# EAGLE schematic Programmable AC Series Limiter (EAGLE 7.6.0)
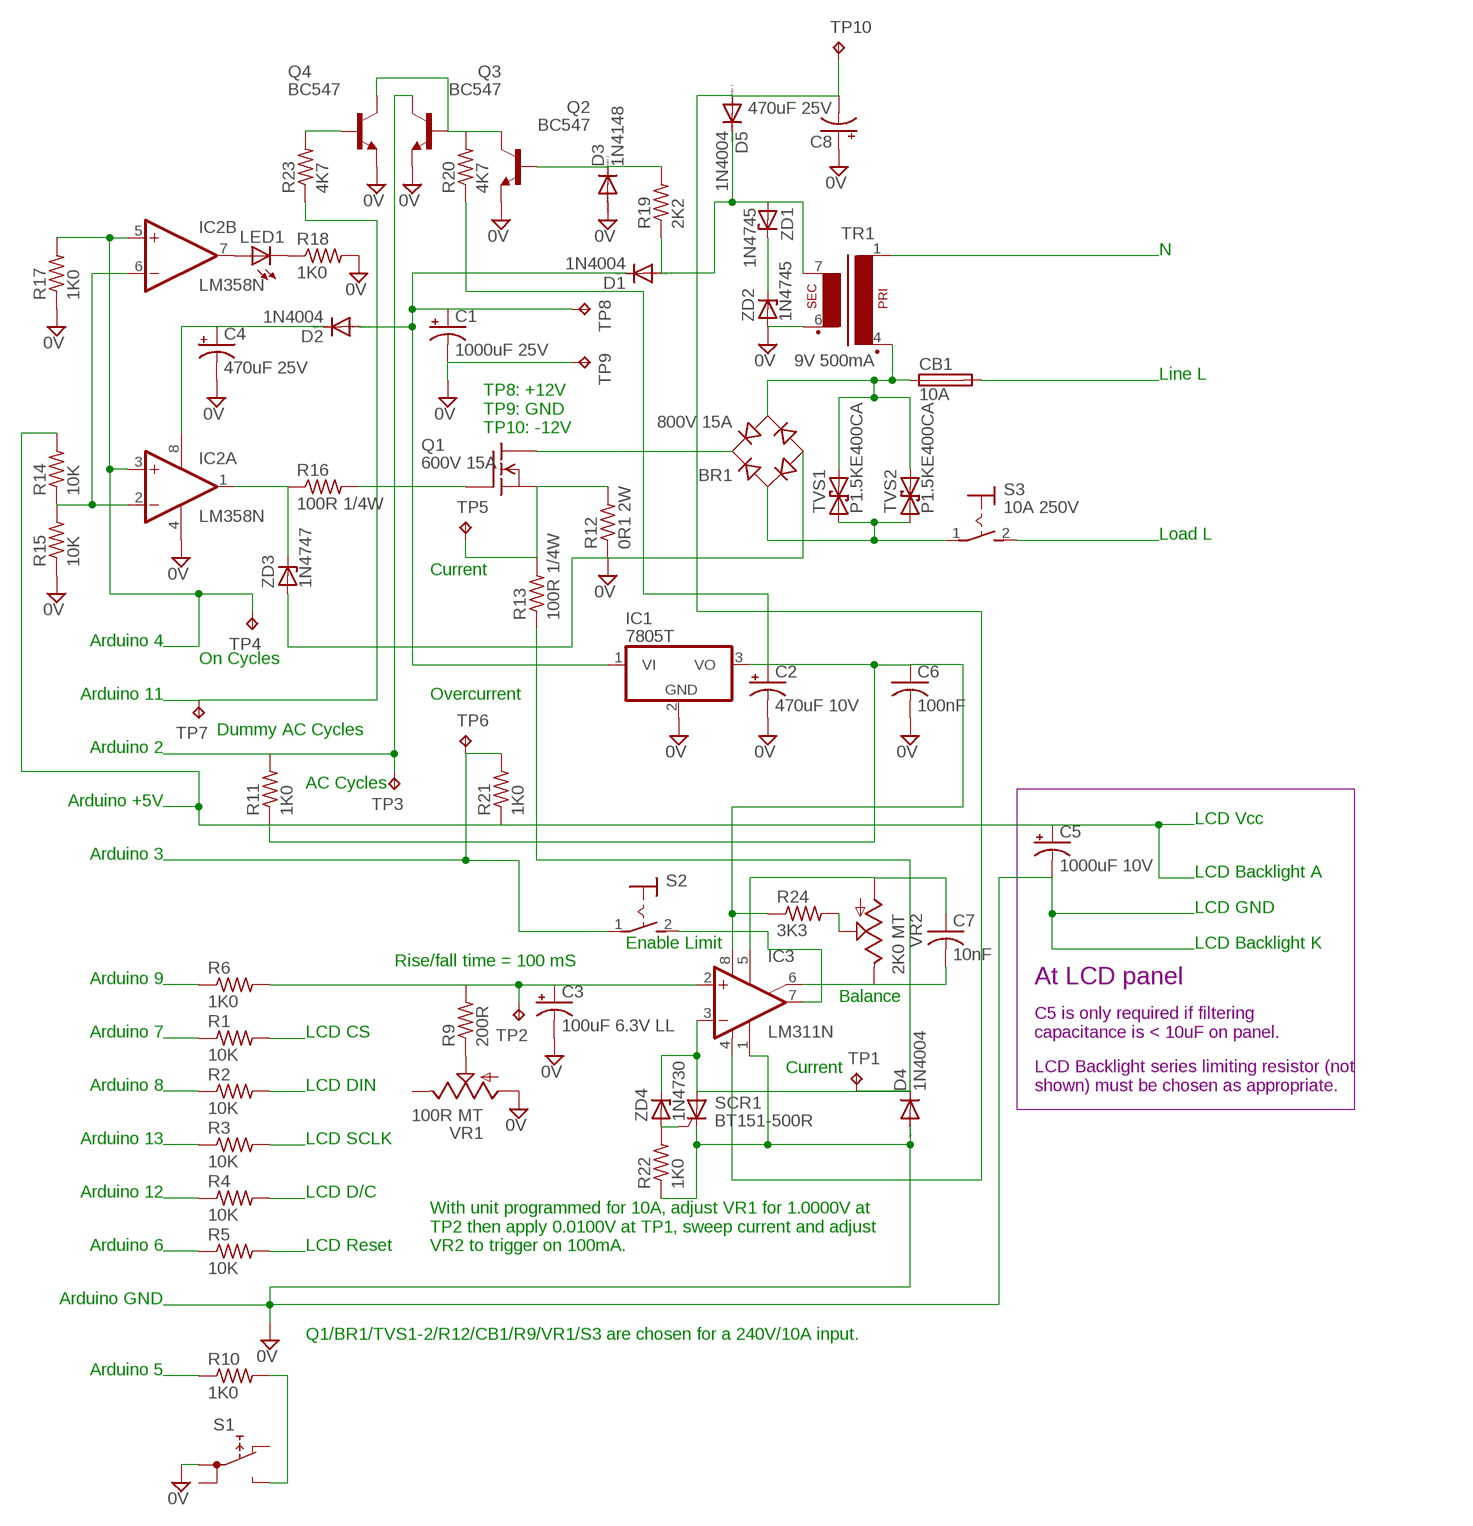
[diagram p0: schematic, sheet 1]

## Parts
BR1  800V 15A  DBDB101G  [DB]
C1  1000uF 25V  CPOL-USB45181A  [B45181A]
C2  470uF 10V  CPOL-USB45181A  [B45181A]
C3  100uF 6.3V LL  CPOL-USB45181A  [B45181A]
C4  470uF 25V  CPOL-USB45181A  [B45181A]
C5  1000uF 10V  CPOL-USB45181A  [B45181A]
C6  100nF  C-US025-024X044  [C025-024X044]
C7  10nF  C-US025-024X044  [C025-024X044]
C8  470uF 25V  CPOL-USB45181A  [B45181A]
CB1  10A  FUSE1821  [FUSE_HOLDER_MENTOR-1821]
D1  1N4004  [DO41-10]
D2  1N4004  [DO41-10]
D3  1N4148  1N4148DO35-7  [DO35-7]
D4  1N4004  [DO41-10]
D5  1N4004  [DO41-10]
IC1  7805T  [TO220H]
IC2  LM358N  [DIL08]
IC3  LM311N  [DIL08]
LED1  LED5MM  [LED5MM]
Q1  600V 15A  BUZ21  [TO220]
Q2  BC547  [TO92]
Q3  BC547  [TO92]
Q4  BC547  [TO92]
R1  10K  R-US_0204/2V  [0204V]
R2  10K  R-US_0204/2V  [0204V]
R3  10K  R-US_0204/2V  [0204V]
R4  10K  R-US_0204/2V  [0204V]
R5  10K  R-US_0204/2V  [0204V]
R6  1K0  R-US_0204/2V  [0204V]
R9  200R  R-US_0204/2V  [0204V]
R10  1K0  R-US_0204/2V  [0204V]
R11  1K0  R-US_0204/2V  [0204V]
R12  0R1 2W  R-US_0204/2V  [0204V]
R13  100R 1/4W  R-US_0204/2V  [0204V]
R14  10K  R-US_0204/2V  [0204V]
R15  10K  R-US_0204/2V  [0204V]
R16  100R 1/4W  R-US_0204/2V  [0204V]
R17  1K0  R-US_0204/2V  [0204V]
R18  1K0  R-US_0204/2V  [0204V]
R19  2K2  R-US_0204/2V  [0204V]
R20  4K7  R-US_0204/2V  [0204V]
R21  1K0  R-US_0204/2V  [0204V]
R22  1K0  R-US_0204/2V  [0204V]
R23  4K7  R-US_0204/2V  [0204V]
R24  3K3  R-US_0204/2V  [0204V]
S1  5501  [5501]
S2  MS243  [MS243]
S3  10A 250V  MS243  [MS243]
SCR1  BT151-500R  BT151  [TO220CL]
TP1  TPB1,27  [B1,27]
TP2  TPB1,27  [B1,27]
TP3  TPB1,27  [B1,27]
TP4  TPB1,27  [B1,27]
TP5  TPB1,27  [B1,27]
TP6  TPB1,27  [B1,27]
TP7  TPB1,27  [B1,27]
TP8  TPB1,27  [B1,27]
TP9  TPB1,27  [B1,27]
TP10  TPB1,27  [B1,27]
TR1  9V 500mA  EE20-1  [EE20-1]
TVS1  P1.5KE400CA  P6KEXXC  [CB417-15]
TVS2  P1.5KE400CA  P6KEXXC  [CB417-15]
VR1  100R MT  US-EVUE2A  [EVUE]
VR2  2K0 MT  US-EVUE2A  [EVUE]
ZD1  1N4745  ZENER-DIODEC1702-15  [C1702-15]
ZD2  1N4745  ZENER-DIODEC1702-15  [C1702-15]
ZD3  1N4747  ZENER-DIODEC1702-15  [C1702-15]
ZD4  1N4730  ZENER-DIODEC1702-15  [C1702-15]

## Nets
GND: BR1.- C1.- C2.- C3.- C4.- C5.- C6.2 C8.+ D3.A D4.A IC1.2(GND) IC2.4(P:V-) IC3.1(GND) Q2.1(E) Q3.1(E) Q4.1(E) R12.1 R15.1 R17.1 R18.2 R22.1 S1.1A SCR1.C TP9.TP TR1.6(S3) VR1.1(A) ZD2.A ZD3.A ; supply symbol labelled 0V
N$1: R1.2
N$2: R2.2
N$3: R3.2
N$4: R4.2
N$5: R5.2
N$6: R1.1
N$7: R2.1
N$8: R3.1
N$9: R4.1
N$10: R5.1
N$11: R22.2 SCR1.G ZD4.A
N$12: BR1.+ Q1.2(D)
N$13: R10.2 S1.NO
N$16: R6.1
N$17: C1.+ D1.C D2.A IC1.1(VI) TP8.TP
N$18: Q1.3(S) R12.2 R13.2 TP5.TP
N$19: D3.C Q2.2(B) R19.2
N$20: IC2.1(A:OUT) R16.1 ZD3.C
N$21: Q2.3(C) Q3.2(B) Q4.3(C) R20.2
N$22: Q1.1(G) R16.2
N$23: TR1.1
N$24: IC2.7(B:OUT) LED1.A
N$25: R9.1 VR1.2(S)
N$26: IC2.2(A:-IN) IC2.6(B:-IN) R14.1 R15.2
N$27: ZD1.C ZD2.C
N$28: BR1.AC2 CB1.A TR1.4(P2) TVS1.C TVS2.C
N$29: CB1.B
N$30: D4.C IC3.3(-IN) R13.1 SCR1.A TP1.TP ZD4.C
N$31: D1.A D5.C R19.1 TR1.7(S4) ZD1.A
N$32: R21.2 S2.1(P) TP6.TP
N$33: R10.1
N$34: IC2.3(A:+IN) IC2.5(B:+IN) R17.2 TP4.TP
N$35: Q3.3(C) R11.2 TP3.TP
N$36: LED1.K(C) R18.1
N$37: C4.+ D2.C IC2.8(P:V+)
N$38: S3.2(S)
N$39: C3.+ IC3.2(+IN) R6.2 R9.2 TP2.TP
N$40: R24.2 VR2.2(S)
N$42: BR1.AC1 S3.1(P) TVS1.A TVS2.A
N$43: C8.- D5.A IC3.4(V-) TP10.TP
N$44: C7.1 IC3.5(ON) VR2.1(A)
N$45: C7.2 IC3.6(ON/STR) VR2.3(E)
N$46: C2.+ C5.+ C6.1 IC1.3(VO) IC3.8(V+) R11.1 R14.2 R20.1 R21.1 R24.1
N$47: R23.1 TP7.TP
N$48: IC3.7(OUT) S2.2(S)
N$49: Q4.2(B) R23.2
Unconnected: S1.1B S1.NC VR1.3(E)

## Notes on the sheet
- N
- Line L
- TP8: +12V
  TP9: GND
  TP10: -12V
- Load L
- Current
- Arduino 4
- On Cycles
- Arduino 11 | Overcurrent
- Dummy AC Cycles
- Arduino 2
- AC Cycles
- Arduino +5V
- LCD Vcc
- Arduino 3
- LCD Backlight A
- LCD GND
- Enable Limit | LCD Backlight K
- Rise/fall time = 100 mS
- Arduino 9 | At LCD panel
- Balance
- Arduino 7 | LCD CS
- C5 is only required if filtering
  capacitance is < 10uF on panel.
- Current
- Arduino 8 | LCD DIN
- LCD Backlight series limiting resistor (not
  shown) must be chosen as appropriate.
- Arduino 13 | LCD SCLK
- Arduino 12 | LCD D/C
- Arduino 6 | LCD Reset
- With unit programmed for 10A, adjust VR1 for 1.0000V at
  TP2 then apply 0.0100V at TP1, sweep current and adjust
  VR2 to trigger on 100mA.
- Arduino GND
- Q1/BR1/TVS1-2/R12/CB1/R9/VR1/S3 are chosen for a 240V/10A input.
- Arduino 5

## Library data of the parts
BR1 = rectifier:DB?*G: Single Phase 1.0 AMP Glass Passivated Bridge Rectifier Taiwan Semiconductor Co.,Ltd. - TSC Source: http://www.taiwansemi.com/TSCbig5/ezcatfiles/cust/img/img/db101g.pdf http://www.ts.com.tw/db/pictures/modules/PDT/PDT060207001/DBLS201G.pdf
C1-C5 C8 = rcl:CPOL-US: POLARIZED CAPACITOR, American symbol
C6 C7 = rcl:C-US: CAPACITOR, American symbol
CB1 = fuse:FUSE: Fuse; OC_FARNELL: unknown; OC_NEWARK: unknown
D1 D2 D4 D5 = diode:1N4004: DIODE general purpose rectifier, 1 A
D3 = diode:1N4148: DIODE high speed (Philips)
IC1 = linear:78*: Positive VOLTAGE REGULATOR Source: http://cache.national.com/ds/LM/LM78L05.pdf http://www.fairchildsemi.com/ds/LM/LM7805.pdf
IC2 = linear:LM358: OP AMP also LM158; LM258; LM2904 Source: http://cache.national.com/ds/LM/LM158.pdf
IC3 = linear:LM311: COMPARATOR
LED1 = led:LED: LED OSRAM: - CHIPLED LG R971, LG N971, LY N971, LG Q971, LY Q971, LO R971, LY R971 LH N974, LH R974 LS Q976, LO Q976, LY Q976 LO Q996 - Hyper CHIPLED LW Q18S LB Q993, LB Q99A, LB R99A - SideLED LS A670, LO A670, LY A670, LG A670, LP A670 LB A673, LV A673, LT A673, LW A673 LH A674 LY A675 LS A676, LA A676, LO A676, LY A676, LW A676 LS A679, LY A679, LG A679 - Hyper Micro SIDELED® LS Y876, LA Y876, LO Y876, LY Y876 LT Y87S - SmartLED LW L88C, LW L88S LB L89C, LB L89S, LG L890 LS L89K, LO L89K, LY L89K LS L896, LA L896, LO L896, LY L896 - TOPLED LS T670, LO T670, LY T670, LG T670, LP T670 LSG T670, LSP T670, LSY T670, LOP T670, LYG T670 LG T671, LOG T671, LSG T671 LB T673, LV T673, LT T673, LW T673 LH T674 LS T676, LA T676, LO T676, LY T676, LB T676, LH T676, LSB T676, LW T676 LB T67C, LV T67C, LT T67C, LS T67K, LO T67K, LY T67K, LW E67C LS E67B, LA E67B, LO E67B, LY E67B, LB E67C, LV E67C, LT E67C LW T67C LS T679, LY T679, LG T679 LS T770, LO T770, LY T770, LG T770, LP T770 LB T773, LV T773, LT T773, LW T773 LH T774 LS E675, LA E675, LY E675, LS T675 LS T776, LA T776, LO T776, LY T776, LB T776 LHGB T686 LT T68C, LB T68C - Hyper Mini TOPLED® LB M676 - Mini TOPLED Santana® LG M470 LS M47K, LO M47K, LY M47K Source: http://www.osram.convergy.de LUXEON: - LUMILED® LXK2-PW12-R00, LXK2-PW12-S00, LXK2-PW14-U00, LXK2-PW14-V00 LXK2-PM12-R00, LXK2-PM12-S00, LXK2-PM14-U00 LXK2-PE12-Q00, LXK2-PE12-R00, LXK2-PE12-S00, LXK2-PE14-T00, LXK2-PE14-U00 LXK2-PB12-K00, LXK2-PB12-L00, LXK2-PB12-M00, LXK2-PB14-N00, LXK2-PB14-P00, LXK2-PB14-Q00 LXK2-PR12-L00, LXK2-PR12-M00, LXK2-PR14-Q00, LXK2-PR14-R00 LXK2-PD12-Q00, LXK2-PD12-R00, LXK2-PD12-S00 LXK2-PH12-R00, LXK2-PH12-S00 LXK2-PL12-P00, LXK2-PL12-Q00, LXK2-PL12-R00 Source: www.luxeon.com KINGBRIGHT: KA-3528ASYC Source: www.kingbright.com
Q1 = transistor-fet:BUZ21: N-Channel Enhancement MOSFET 100V; 19A; 0,1Ohm
Q2-Q4 = transistor-npn:BC547*: NPN Transistor
R1-R6 R9-R24 = resistor:R-US_: RESISTOR, American symbol
S1 = switch:55?: PUSHBUTTON SERIES 5500 SWITCHES Source: www.e-switch.com .. 5500.pdf
S2 S3 = switch:MS243: TOGGLE SWITCH
SCR1 = triac:BT151: THYRISTOR
TP1-TP10 = testpad:TP: Test pad
TR1 = trafo:EE20-1: TRANSFORMER 1 primary winding, 1 secondary winding ERA
TVS1 TVS2 = diode:P6KEXXC: DIODE transient-voltage suppressor
VR1 VR2 = pot:US-EVU: 9 mm Square Rotary Potentiometers Source: Panasonic
ZD1-ZD4 = diode:ZENER-DIODE: Z-Diode